# EAGLE design protected-input (EAGLE 5.06)
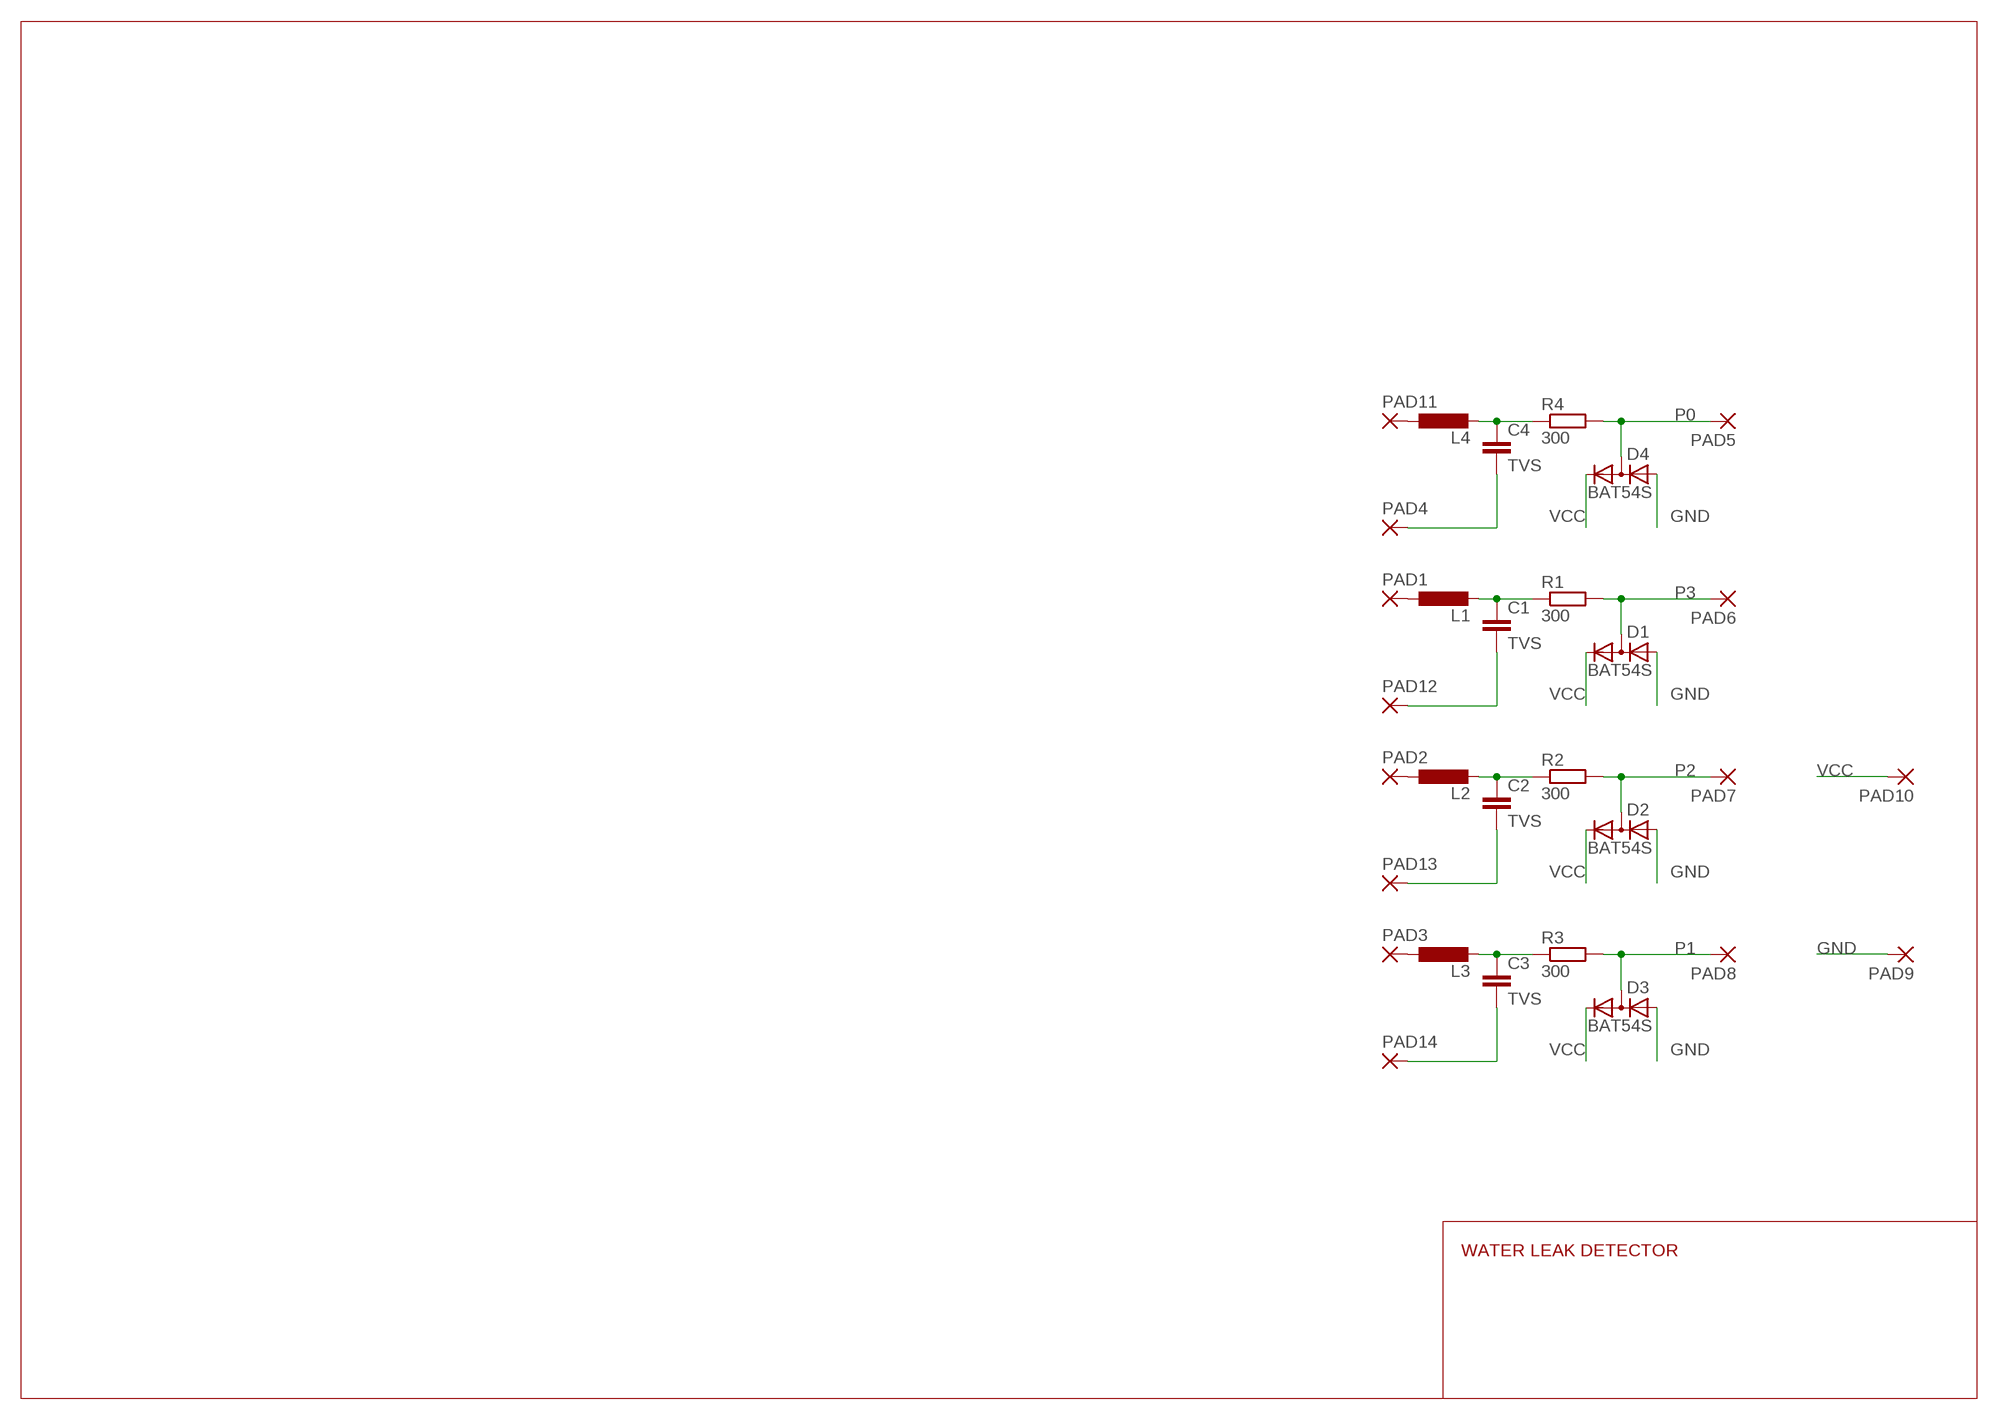
[diagram p0: schematic, sheet 1]

## Parts
C1  TVS  C-EUC1210  [C1210]
C2  TVS  C-EUC1210  [C1210]
C3  TVS  C-EUC1210  [C1210]
C4  TVS  C-EUC1210  [C1210]
D1  BAT54S  DIODE_2CACA-SOT23  [SOT23]
D2  BAT54S  DIODE_2CACA-SOT23  [SOT23]
D3  BAT54S  DIODE_2CACA-SOT23  [SOT23]
D4  BAT54S  DIODE_2CACA-SOT23  [SOT23]
L1  L-EU0204/7  [0204/7]
L2  L-EU0204/7  [0204/7]
L3  L-EU0204/7  [0204/7]
L4  L-EU0204/7  [0204/7]
PAD1  1,6/0,8  [1,6/0,8]
PAD2  1,6/0,8  [1,6/0,8]
PAD3  1,6/0,8  [1,6/0,8]
PAD4  1,6/0,8  [1,6/0,8]
PAD5  2,15/1,0  [2,15/1,0]
PAD6  2,15/1,0  [2,15/1,0]
PAD7  2,15/1,0  [2,15/1,0]
PAD8  2,15/1,0  [2,15/1,0]
PAD9  2,15/1,0  [2,15/1,0]
PAD10  2,15/1,0  [2,15/1,0]
PAD11  1,6/0,8  [1,6/0,8]
PAD12  1,6/0,8  [1,6/0,8]
PAD13  1,6/0,8  [1,6/0,8]
PAD14  1,6/0,8  [1,6/0,8]
R1  300  R-EU_R0805  [R0805]
R2  300  R-EU_R0805  [R0805]
R3  300  R-EU_R0805  [R0805]
R4  300  R-EU_R0805  [R0805]

## Nets
GND: C1.2 C2.2 C3.2 C4.2 D1.1(A) D2.1(A) D3.1(A) D4.1(A) PAD4.1(P) PAD9.1(P) PAD12.1(P) PAD13.1(P) PAD14.1(P)
N$1: C1.1 L1.2 R1.1
N$2: L1.1 PAD1.1(P)
N$3: C2.1 L2.2 R2.1
N$4: L2.1 PAD2.1(P)
N$5: C3.1 L3.2 R3.1
N$6: L3.1 PAD3.1(P)
N$7: C4.1 L4.2 R4.1
N$8: L4.1 PAD11.1(P)
P0: D4.3(AC) PAD5.1(P) R4.2
P1: D3.3(AC) PAD8.1(P) R3.2
P2: D2.3(AC) PAD7.1(P) R2.2
P3: D1.3(AC) PAD6.1(P) R1.2
VCC: D1.2(C) D2.2(C) D3.2(C) D4.2(C) PAD10.1(P)

## Notes on the sheet
- WATER LEAK DETECTOR

## Library data of the parts
C1-C4 = rcl:C-EU: CAPACITOR, European symbol
D1-D4 = diode:DIODE_2CACA-: 2 Diodes - Cathode-Anode|Cathode-Anode
L1-L4 = resistor:L-EU: INDUCTOR, European symbol
PAD1-PAD4 PAD11-PAD14 = wirepad:1,6/0,8: THROUGH-HOLE PAD
PAD5-PAD10 = wirepad:2,15/1,0: THROUGH-HOLE PAD
R1-R4 = resistor:R-EU_: RESISTOR, European symbol

## Net classes
1 thin: width 0.254 mm
2 z: width 0.127 mm

## Board
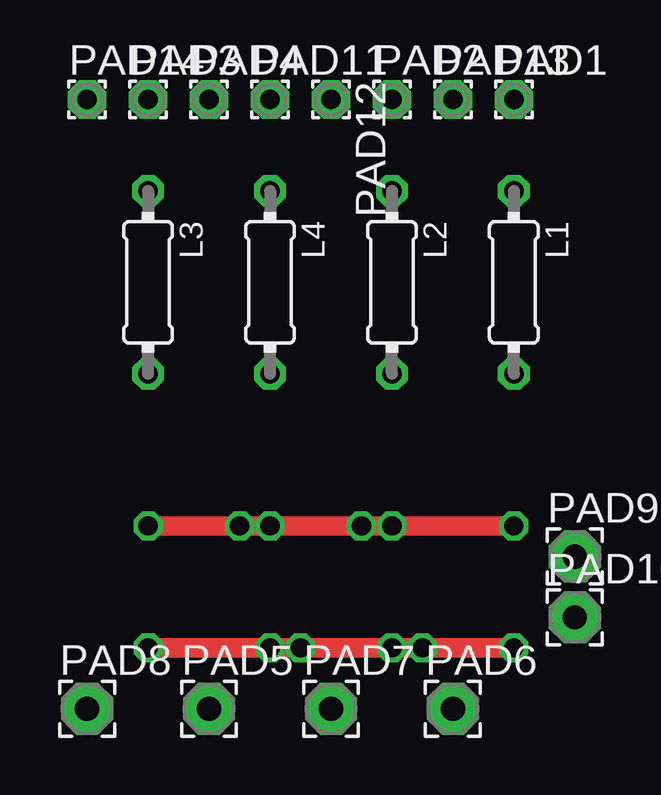
[diagram p1: board, top side]
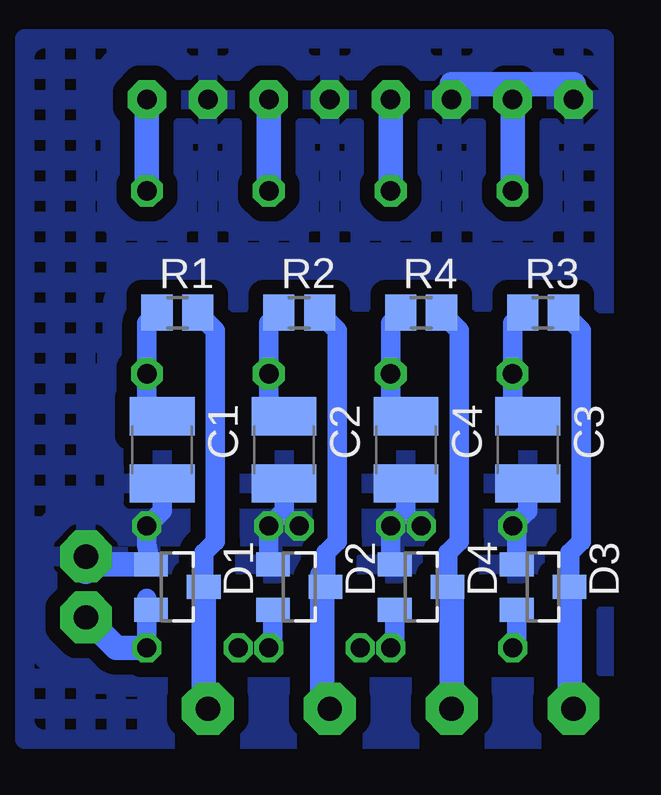
[diagram p2: board, bottom side, seen from below]

No outline drawn. Coordinates in mm, seen from the top.
Copper layers (1*16): Top 0.035mm / dielectric 1.5mm / Bottom 0.035mm
Design rules "default": minimum track width 10mil, minimum drill 24mil, track to track 8mil, track to pad 8mil, pad to pad 8mil, via to via 8mil, smd to smd 8mil, copper to edge 40mil, drill to drill 8mil, minimum pad ring 10mil, minimum via ring 8mil, stop-mask expansion 4mil, vias tented up to drill 0mil, thermal gap 10mil

### Footprints (pad centres in the part's own frame; a part is rotated, then mirrored left to right if it is on the bottom)
C1210 = smd 1.6 x 2.7: 1 -1.4,0; 2 1.4,0
SOT23 = smd 1 x 1.4: 1 -0.95,-1.1; 2 0.95,-1.1; 3 0,1.1
0204/7 = drill 0.813 octagon: 1 -3.81,0; 2 3.81,0
1,6/0,8 = drill 0.813 pad 1.6 octagon: 1 0,0
2,15/1,0 = drill 1.016 pad 2.159 octagon: 1 0,0
R0805 = smd 1.3 x 1.5: 1 -0.85,0; 2 0.85,0

### Placement (x,y rotation side)
C1  18.41,12.06 270 bottom
C2  13.34,12.06 270 bottom
C3  3.17,12.06 270 bottom
C4  8.26,12.06 270 bottom
D1  17.78,6.35 270 bottom
D2  12.7,6.35 270 bottom
D3  2.54,6.35 270 bottom
D4  7.62,6.35 270 bottom
L1  19.05,19.05 270 top
L2  13.97,19.05 270 top
L3  3.81,19.05 270 top
L4  8.89,19.05 270 top
PAD1  19.05,26.67 0 top
PAD2  13.97,26.67 0 top
PAD3  3.81,26.67 0 top
PAD4  6.35,26.67 0 top
PAD5  6.35,1.27 0 top
PAD6  16.51,1.27 0 top
PAD7  11.43,1.27 0 top
PAD8  1.27,1.27 0 top
PAD9  21.59,7.62 0 top
PAD10  21.59,5.08 0 top
PAD11  8.89,26.67 0 top
PAD12  11.43,26.67 270 top
PAD13  16.51,26.67 0 top
PAD14  1.27,26.67 0 top
R1  17.78,17.78 0 bottom
R2  12.7,17.78 0 bottom
R3  2.54,17.78 0 bottom
R4  7.62,17.78 0 bottom

### Tracks (layer width: path | path; a pad name or v marks a point on that pad's centre or on a via)
GND  (via drill 0.8)
  Top 0.813: v19.05,8.89 17.78,8.89 v13.97,8.89 v12.7,8.89 v8.89,8.89 v7.62,8.89 v3.81,8.89
  Bottom 0.406: 6.35,27.3 PAD4.1
  Bottom 0.813: C2.2 13.34,9.53 v13.97,8.89 13.97,7.47 D2.1 | D1.1 19.05,8.11 v19.05,8.89 18.41,9.53 C1.2 | C4.2 8.26,9.53 v8.89,8.89 8.89,7.47 D4.1 | D3.1 3.64,8.72 v3.81,8.89 3.17,9.53 C3.2
  Bottom 1.016: D1.1 21.27,7.3 21.59,6.99 | 6.35,27.3 1.27,27.3 PAD14.1
  pour Bottom (isolate 0.61, hatched): 0,0 24.13,0 24.13,29.21 0,29.21
N$1
  Bottom 0.813: C1.1 19.05,13.46 L1.2 19.05,17.36 R1.1
N$2
  Bottom 1.016: L1.1 PAD1.1
N$3
  Bottom 0.813: R2.1 13.97,17.36 L2.2 13.97,14.1 C2.1
N$4
  Bottom 1.016: L2.1 PAD2.1
N$5
  Bottom 0.813: R3.1 3.81,17.36 L3.2 3.81,14.1 C3.1
N$6
  Bottom 1.016: L3.1 PAD3.1
N$7
  Bottom 0.813: R4.1 8.89,17.36 L4.2 8.89,14.1 C4.1
N$8
  Bottom 1.016: L4.1 PAD11.1
P0
  Bottom 0.813: 6.35,6.18 D4.3 6.52,7.77 6.03,8.26 6.03,17.04 R4.2
  Bottom 1.016: PAD5.1 6.35,6.18
P1
  Bottom 0.813: D3.3 1.44,7.77 0.95,8.26 0.95,17.04 R3.2
  Bottom 1.016: D3.3 1.44,1.44 PAD8.1
P2
  Bottom 0.813: 11.75,6.84 D2.3 11.6,7.77 11.11,8.26 11.11,17.04 R2.2
  Bottom 1.016: 11.75,6.84 11.75,1.59 PAD7.1
P3
  Bottom 0.813: D1.3 16.68,7.77 16.19,8.26 16.19,17.04 R1.2
  Bottom 1.016: D1.3 16.68,1.44 PAD6.1
VCC  (via drill 0.8)
  Top 0.813: v19.05,3.81 v15.24,3.81 v13.97,3.81 v10.16,3.81 v8.89,3.81 5.08,3.81 v3.81,3.81
  Bottom 0.813: v19.05,3.81 19.05,5.87 D1.2 | D2.2 13.8,3.98 v13.97,3.81 | D4.2 8.72,3.98 v8.89,3.81 | D3.2 3.64,3.98 v3.81,3.81
  Bottom 1.016: PAD10.1 20.32,3.81 v19.05,3.81